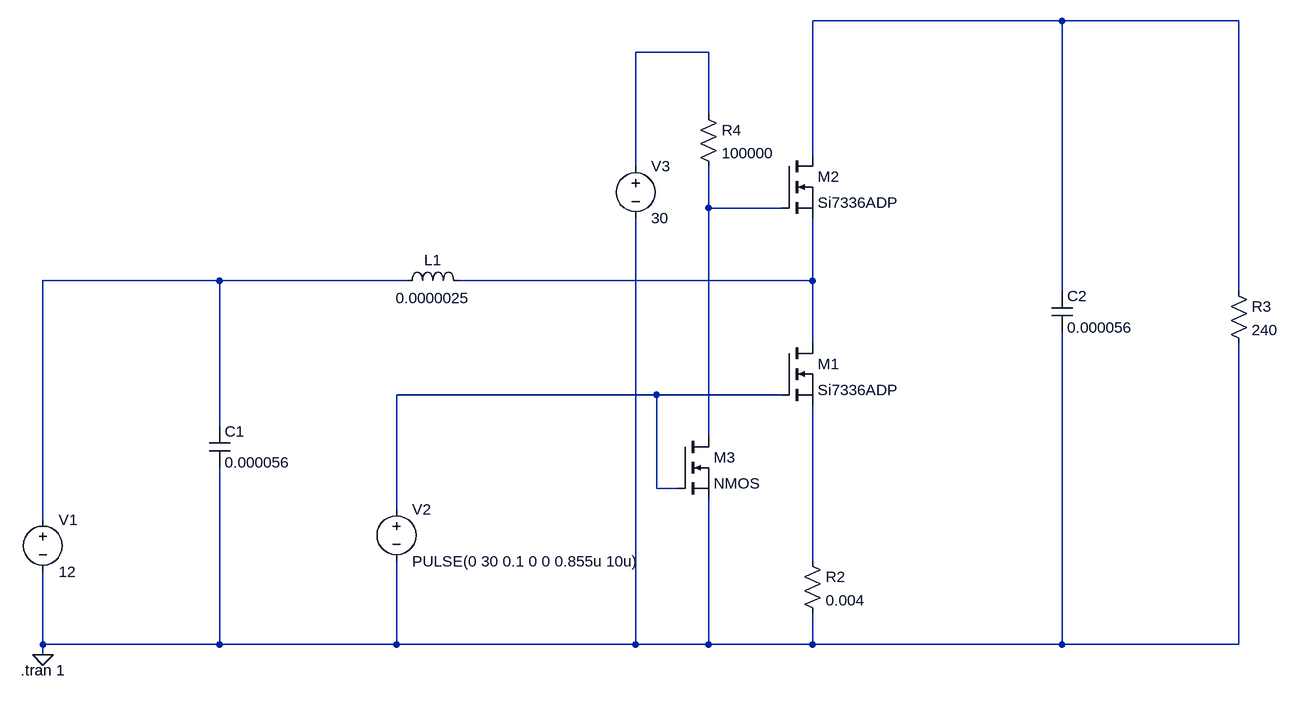
[diagram p0: schematic Draft3.asc]
Draft3.asc, the LTspice schematic file:
Version 4
SHEET 1 1504 680
WIRE 1136 -624 752 -624
WIRE 1408 -624 1136 -624
WIRE 592 -576 480 -576
WIRE 592 -480 592 -576
WIRE 752 -416 752 -624
WIRE 480 -400 480 -576
WIRE 592 -336 592 -400
WIRE 704 -336 592 -336
WIRE -160 -224 -432 -224
WIRE 128 -224 -160 -224
WIRE 752 -224 752 -320
WIRE 752 -224 208 -224
WIRE 1136 -208 1136 -624
WIRE 1408 -208 1408 -624
WIRE 752 -128 752 -224
WIRE 512 -48 112 -48
WIRE 704 -48 512 -48
WIRE -160 0 -160 -224
WIRE 592 16 592 -336
WIRE 512 96 512 -48
WIRE 544 96 512 96
WIRE 112 128 112 -48
WIRE -432 144 -432 -224
WIRE 752 208 752 -32
WIRE -432 336 -432 224
WIRE -160 336 -160 64
WIRE -160 336 -432 336
WIRE 112 336 112 208
WIRE 112 336 -160 336
WIRE 480 336 480 -320
WIRE 480 336 112 336
WIRE 592 336 592 112
WIRE 592 336 480 336
WIRE 752 336 752 288
WIRE 752 336 592 336
WIRE 1136 336 1136 -144
WIRE 1136 336 752 336
WIRE 1408 336 1408 -128
WIRE 1408 336 1136 336
WIRE -432 352 -432 336
FLAG -432 352 0
SYMBOL ind 112 -208 R270
WINDOW 0 32 56 VTop 2
WINDOW 3 5 56 VBottom 2
SYMATTR InstName L1
SYMATTR Value 0.0000025
SYMATTR SpiceLine Ipk=100 Rser=2.6m
SYMBOL voltage -432 128 R0
WINDOW 123 0 0 Left 0
WINDOW 39 0 0 Left 0
SYMATTR InstName V1
SYMATTR Value 12
SYMBOL cap -176 0 R0
SYMATTR InstName C1
SYMATTR Value 0.000056
SYMATTR SpiceLine Rser=0.002
SYMBOL res 736 192 R0
SYMATTR InstName R2
SYMATTR Value 0.004
SYMBOL nmos 704 -128 R0
SYMATTR InstName M1
SYMATTR Value Si7336ADP
SYMBOL nmos 704 -416 R0
SYMATTR InstName M2
SYMATTR Value Si7336ADP
SYMBOL cap 1120 -208 R0
SYMATTR InstName C2
SYMATTR Value 0.000056
SYMATTR SpiceLine Rser=0.002
SYMBOL res 1392 -224 R0
SYMATTR InstName R3
SYMATTR Value 240
SYMBOL voltage 112 112 R0
WINDOW 123 0 0 Left 0
WINDOW 39 0 0 Left 0
SYMATTR InstName V2
SYMATTR Value PULSE(0 30 0.1 0 0 0.855u 10u)
SYMBOL nmos 544 16 R0
SYMATTR InstName M3
SYMBOL voltage 480 -416 R0
WINDOW 123 0 0 Left 0
WINDOW 39 0 0 Left 0
SYMATTR InstName V3
SYMATTR Value 30
SYMBOL res 576 -496 R0
SYMATTR InstName R4
SYMATTR Value 100000
TEXT -466 376 Left 2 !.tran 1

The netlist it stands for:
* Draft3.asc
L1 N004 N005 0.0000025 Ipk=100 Rser=2.6m
V1 N004 0 12
C1 N004 0 0.000056 Rser=0.002
R2 N007 0 0.004
M1 N005 N006 N007 N007 Si7336ADP
M2 N001 N003 N005 N005 Si7336ADP
C2 N001 0 0.000056 Rser=0.002
R3 N001 0 240
V2 N006 0 PULSE(0 30 0.1 0 0 0.855u 10u)
M3 N003 N006 0 0 NMOS
V3 N002 0 30
R4 N002 N003 100000
.model NMOS NMOS
.model PMOS PMOS
.lib standard.mos
.tran 1
.backanno
.end